# Altium schematic sheet TempSensor.SchDoc
size A4; Organization: Altium Limited; Address1: L3, 12a Rodborough Rd; Address2: Frenchs Forest; Address3: NSW; Address4: Australia 2086; DocumentNumber: 7; SheetNumber: 7; SheetTotal: 12
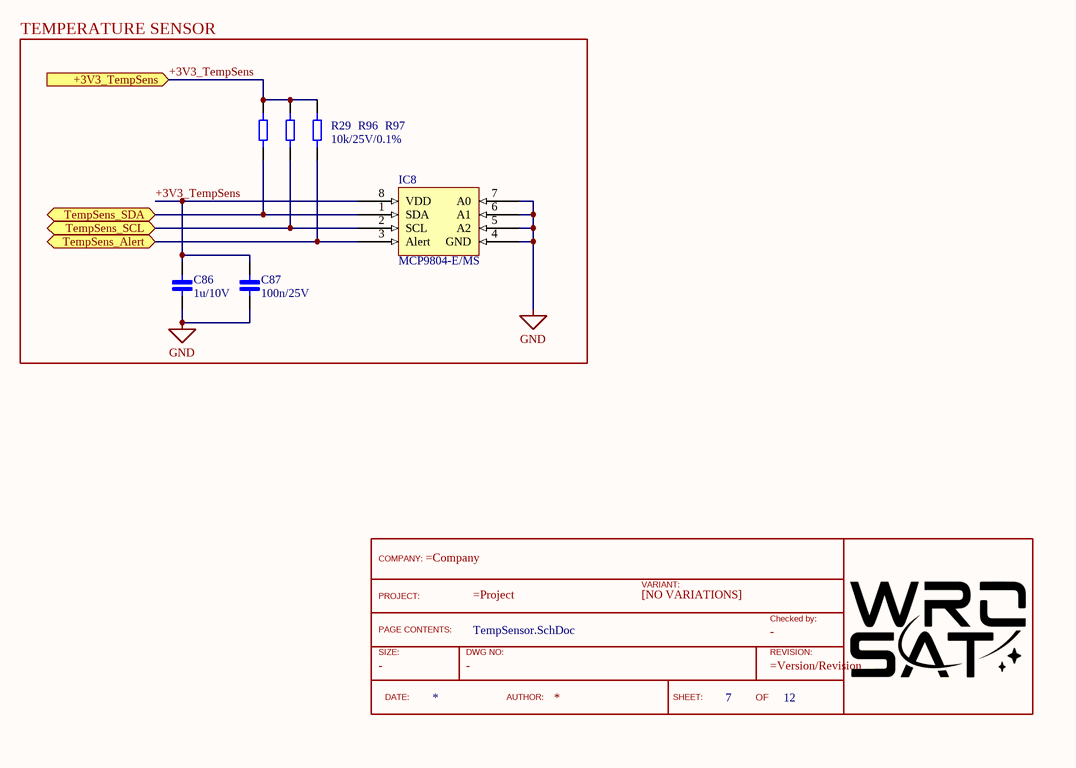
[diagram p0: TempSensor.SchDoc]

## Parts
?  TitleBlock  (value not drawn)  (graphical)
C86  1u/10V  [Cap_0402]
C87  100n/25V  [Cap_0402]
IC8  MCP9804-E/MS  [MSOP-8]
R29  10k/25V/0.1%  [RES_0402]
R96  10k/25V/0.1%  [RES_0402]  (value not drawn)
R97  10k/25V/0.1%  [RES_0402]  (value not drawn)

## Blocks framed on the sheet
TEMPERATURE SENSOR: C86 C87 IC8 R29 R96 R97

## Ports
+3V3_TempSens (in), TempSens_Alert (bidir), TempSens_SCL (bidir), TempSens_SDA (bidir)

## Nets
GND: C86.1 C87.1 IC8.4(GND) IC8.5(A2) IC8.6(A1) IC8.7(A0)
+3V3_TempSens: C86.2 C87.2 IC8.8(VDD) R29.2 R96.2 R97.2 ; port +3V3_TempSens
TempSens_Alert: IC8.3(Alert) R97.1 ; port TempSens_Alert
TempSens_SCL: IC8.2(SCL) R96.1 ; port TempSens_SCL
TempSens_SDA: IC8.1(SDA) R29.1 ; port TempSens_SDA

## Notes on the sheet
- Title
- Size:
- Date:
- A3
- Number:
- Time:
- Revision:
- Sheet
- of
- File:
- (in symbol TitleBlock) COMPANY:; VARIANT:; PROJECT:; [NO VARIATIONS]; Checked by:; PAGE CONTENTS:; SIZE:; DWG NO:; REVISION:; DATE:; AUTHOR:; SHEET:; OF

## Library data of the parts
? = TitleBlock: Standard TitleBlock; DrawingNo: -; Size: -; Checked: -
C86 = Cap_0402_1u: Ceramic Capacitor 1uF / 0402 / 10V / ±5%, Wurth Elektronik MLCC
C87 = Cap_0402_100n: Ceramic Capacitor 100n / 0402 / 25V / ±5%, Wurth Elektronik MLCC; ComponentLink1Description: New link; ComponentLink1URL: https://www.we-online.com/catalog/en/WCAP-CSGP-25VDC
IC8 = MCP9804-E/MS: Temp Sensor Digital Serial (2-Wire) Automotive 8-Pin MSOP; Manufacturer: Microchip; Interface: I2C,SMBus,2-Wire,Serial; Max Supply Voltage: 5.5V; Min Supply Voltage: 2.7V; Resolution: 12b; Output Type: I2C,Digital; Operating Supply Current: 200uA; Accuracy: 1%; Sensor Type: Temperature; Output Current: 1uA; Number of Bits: 12; Supplier 1: Digi-Key; Manufacturer Part Number: MCP9804-E/MS; RoHS: Yes; Category: Temperature and Humidity Sensors; Stock 1: 933; Pricing 1: 1=1.68000, 25=1.40000, 100=1.27000 (USD); Mount: Surface Mount; Case/Package: MSOP; Number of Pins: 8; Contact Plating: Tin,Matte; Min Operating Temperature: -40°C; Max Operating Temperature: 125°C; Packaging: Rail/Tube; Package Quantity: 100; Max Supply Voltage (DC): 5.5V; Min Supply Voltage (DC): 2.7V; Termination: SMD/SMT; Max Output Current: 200uA; Length: 0.118inch; Width: 0.118inch; Height: 0.037inch; Radiation Hardening: No; Lead Free: Lead Free; REACH SVHC: No SVHC; ComponentLink1URL: https://datasheet.ciiva.com/16635/22203b-16635824.pdf?src-supplier=Avnet+Europe; ComponentLink1Description: https://datasheet.ciiva.com/16635/22203b-16635824.pdf?src-supplier=Avnet+Europe; ComponentLink2URL: https://datasheet.ciiva.com/2002/22203c-2002916.pdf?src-supplier=Digi-Key; ComponentLink2Description: https://datasheet.ciiva.com/2002/22203c-2002916.pdf?src-supplier=Digi-Key; ComponentLink3URL: https://datasheet.ciiva.com/16453/filehandler-aspxddocname-en544703-16453766.pdf?src-supplier=Future+Electronics; ComponentLink3Description: https://datasheet.ciiva.com/16453/filehandler-aspxddocname-en544703-16453766.pdf?src-supplier=Future+Electronics; ComponentLink4URL: https://datasheet.ciiva.com/3278/22203b-3278286.pdf?src-supplier=Avnet; ComponentLink4Description: https://datasheet.ciiva.com/3278/22203b-3278286.pdf?src-supplier=Avnet; ComponentLink5URL: https://datasheet.ciiva.com/26344/651539-da-01-en-ic-temp-sens-mcp9804-e-ms-msop-8-mcp-26344475.pdf?src-supplier=Conrad; ComponentLink5Description: https://datasheet.ciiva.com/26344/651539-da-01-en-ic-temp-sens-mcp9804-e-ms-msop-8-mcp-26344475.pdf?src-supplier=Conrad; Supplier Part Number 1: MCP9804-E/MS-ND
R29 R96 R97 = Res_0402_10k: Vishay, thin film resistor 10k/25V/0.1%